# EAGLE design multi_sense32 (EAGLE 9.6.2)
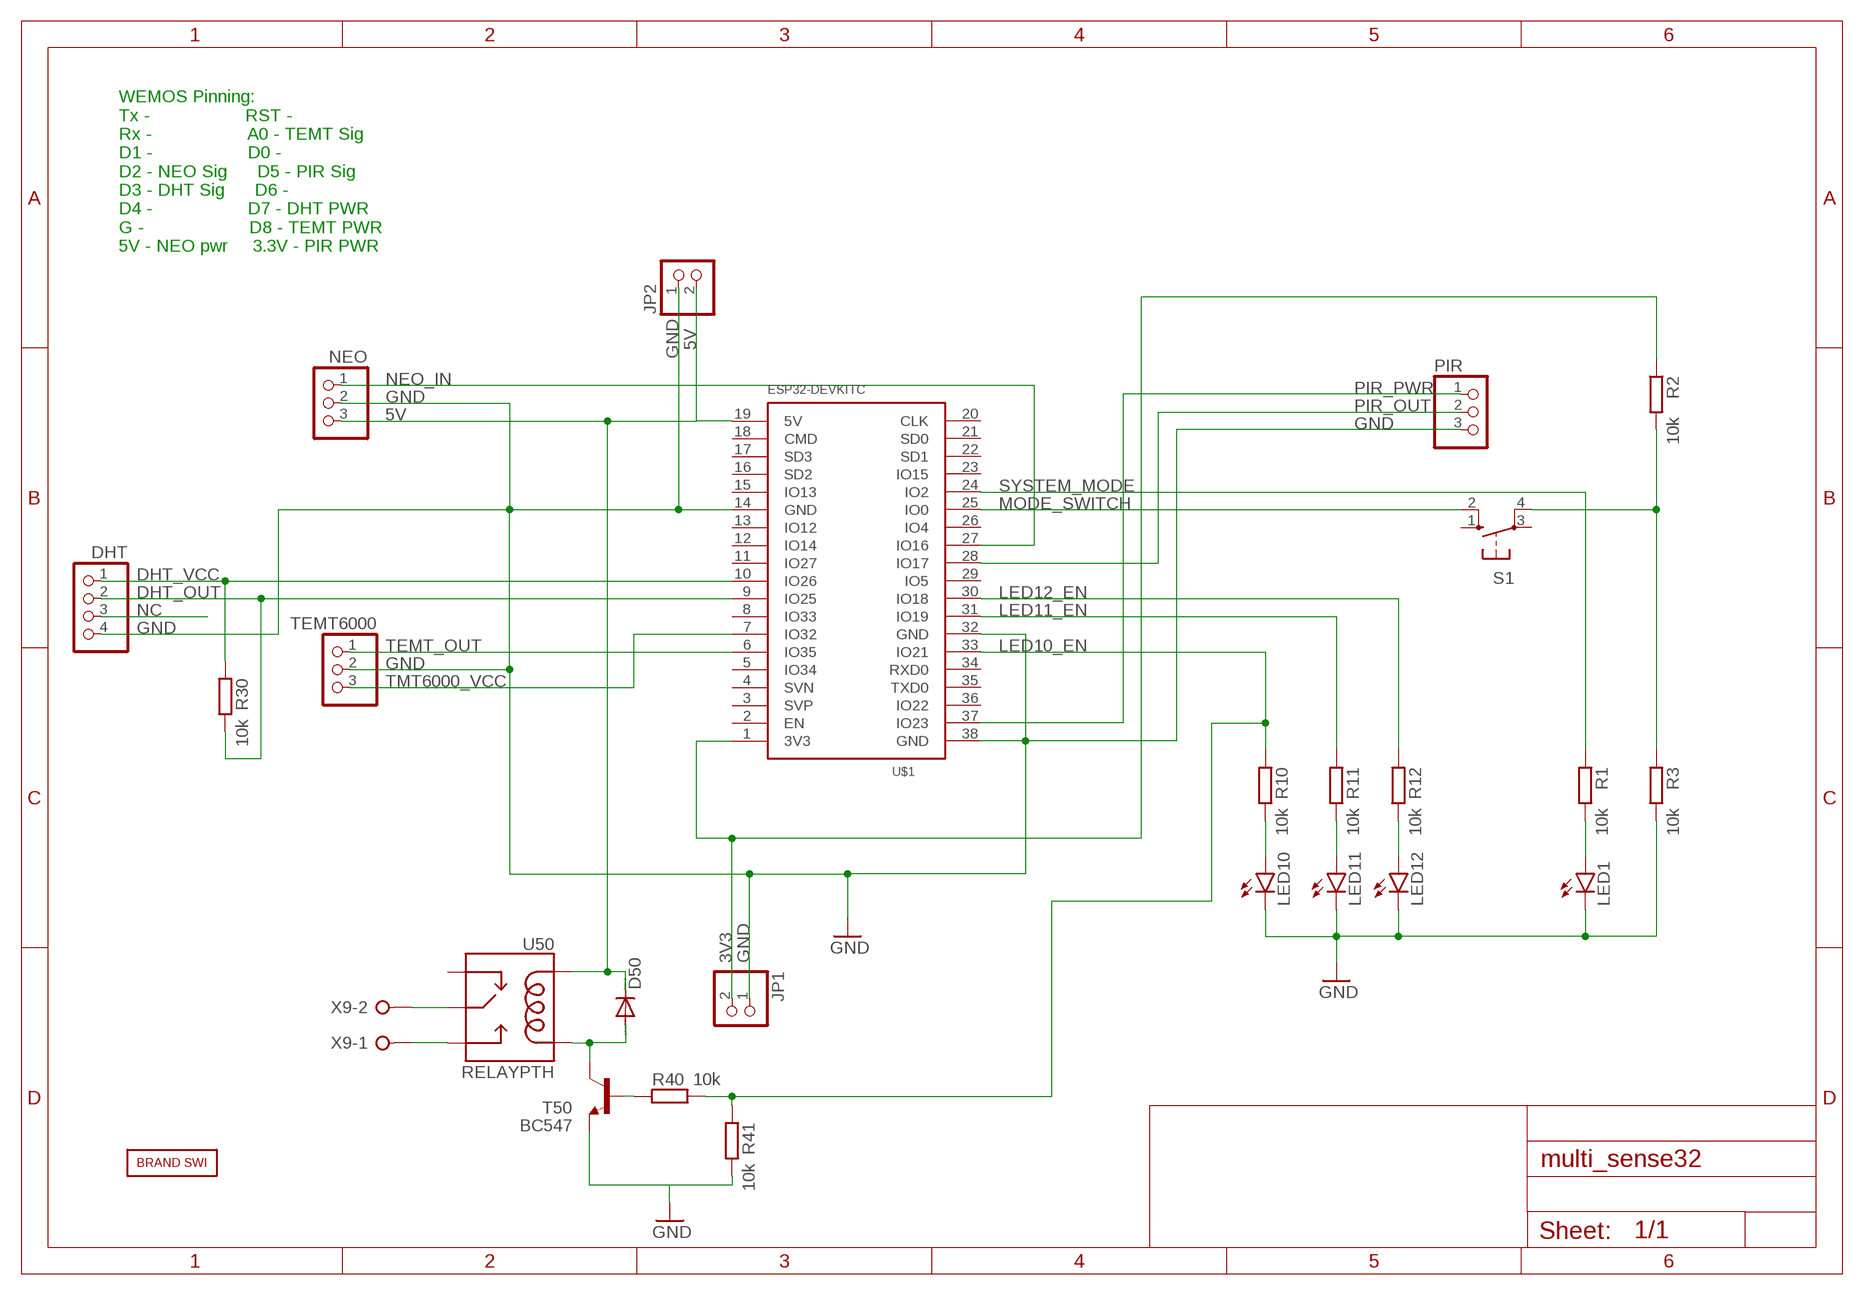
[diagram p0: schematic, sheet 1]

## Parts
D50  1N4148DO35-7  [DO35-7]
DHT  PINHD-1X4  [1X04]
JP1  PINHD-1X2  [1X02]
JP2  PINHD-1X2  [1X02]
LED1  LED3MM  [LED3MM]
LED10  LED3MM  [LED3MM]
LED11  LED3MM  [LED3MM]
LED12  LED3MM  [LED3MM]
NEO  PINHD-1X3  [1X03]
PIR  PINHD-1X3  [1X03]
R1  10k  R-EU_0207/10  [0207/10]
R2  10k  R-EU_0207/10  [0207/10]
R3  10k  R-EU_0207/10  [0207/10]
R10  10k  R-EU_0207/10  [0207/10]
R11  10k  R-EU_0207/10  [0207/10]
R12  10k  R-EU_0207/10  [0207/10]
R30  10k  R-EU_0207/10  [0207/10]
R40  10k  R-EU_0207/10  [0207/10]
R41  10k  R-EU_0207/10  [0207/10]
S1  10-XX  [B3F-10XX]
T50  BC547  [TO92]
TEMT6000  PINHD-1X3  [1X03]
U50  RELAYPTH  [SRD-05VDC-SL-C]
U$1  ESP32DEVKITC  [ESP32-DEVKITC]
U$2  BRAND_SWI5X7  [BRAND_SWI_5X7]
X9  W237-02P  [W237-132]

## Nets
3V3: JP1.2 R2.1 U$1.1(3V3)
5V: D50.C JP2.2 NEO.3 U50.COIL1 U$1.19(5V)
DHT_OUT: DHT.2 R30.2 U$1.9(IO25)
DHT_VCC: DHT.1 R30.1 U$1.10(IO26)
GND: DHT.4 JP1.1 JP2.1 LED1.K(C) LED10.K(C) LED11.K(C) LED12.K(C) NEO.2 PIR.3 R3.2 R41.2 T50.1(E) TEMT6000.2 U$1.14(GND) U$1.32(GND) U$1.38(GND)
LED10_EN: R10.1 R40.2 R41.1 U$1.33(IO21)
LED11_EN: R11.1 U$1.31(IO19)
LED12_EN: R12.1 U$1.30(IO18)
MODE_SWITCH: S1.2(S1) U$1.25(IO0)
N$1: U50.SWOPEN X9.1
N$2: LED10.A R10.2
N$3: U50.SWCOMMON X9.2
N$4: LED11.A R11.2
N$5: LED12.A R12.2
N$6: R2.2 R3.1 S1.4(P1)
N$9: LED1.A R1.2
N$22: D50.A T50.3(C) U50.COIL0
N$27: R40.1 T50.2(B)
NC: DHT.3
NEO_IN: NEO.1 U$1.27(IO16)
PIR_OUT: PIR.2 U$1.28(IO17)
PIR_PWR: PIR.1 U$1.37(IO23)
SYSTEM_MODE: R1.1 U$1.24(IO2)
TEMT_OUT: TEMT6000.1 U$1.6(IO35)
TMT6000_VCC: TEMT6000.3 U$1.7(IO32)
Unconnected: S1.1(S) S1.3(P) U50.SWCLOSED(SWCLOSE) U$1.2(EN) U$1.3(SVP) U$1.4(SVN) U$1.5(IO34) U$1.8(IO33) U$1.11(IO27) U$1.12(IO14) U$1.13(IO12) U$1.15(IO13) U$1.16(SD2) U$1.17(SD3) U$1.18(CMD) U$1.20(CLK) U$1.21(SD0) U$1.22(SD1) U$1.23(IO15) U$1.26(IO4) U$1.29(IO5) U$1.34(RXD0) U$1.35(TXD0) U$1.36(IO22)

## Notes on the sheet
- WEMOS Pinning:
  Tx -                   RST - 
  Rx -                   A0 - TEMT Sig
  D1 -                   D0 - 
  D2 - NEO Sig      D5 - PIR Sig
  D3 - DHT Sig      D6 - 
  D4 -                   D7 - DHT PWR
  G -                     D8 - TEMT PWR
  5V - NEO pwr     3.3V - PIR PWR

## Library data of the parts
D50 = diode:1N4148: DIODE high speed (Philips)
DHT = pinhead:PINHD-1X4: PIN HEADER
JP1 JP2 = pinhead:PINHD-1X2: PIN HEADER
LED1 LED10-LED12 = led:LED: LED OSRAM: - CHIPLED LG R971, LG N971, LY N971, LG Q971, LY Q971, LO R971, LY R971 LH N974, LH R974 LS Q976, LO Q976, LY Q976 LO Q996 - Hyper CHIPLED LW Q18S LB Q993, LB Q99A, LB R99A - SideLED LS A670, LO A670, LY A670, LG A670, LP A670 LB A673, LV A673, LT A673, LW A673 LH A674 LY A675 LS A676, LA A676, LO A676, LY A676, LW A676 LS A679, LY A679, LG A679 - Hyper Micro SIDELED® LS Y876, LA Y876, LO Y876, LY Y876 LT Y87S - SmartLED LW L88C, LW L88S LB L89C, LB L89S, LG L890 LS L89K, LO L89K, LY L89K LS L896, LA L896, LO L896, LY L896 - TOPLED LS T670, LO T670, LY T670, LG T670, LP T670 LSG T670, LSP T670, LSY T670, LOP T670, LYG T670 LG T671, LOG T671, LSG T671 LB T673, LV T673, LT T673, LW T673 LH T674 LS T676, LA T676, LO T676, LY T676, LB T676, LH T676, LSB T676, LW T676 LB T67C, LV T67C, LT T67C, LS T67K, LO T67K, LY T67K, LW E67C LS E67B, LA E67B, LO E67B, LY E67B, LB E67C, LV E67C, LT E67C LW T67C LS T679, LY T679, LG T679 LS T770, LO T770, LY T770, LG T770, LP T770 LB T773, LV T773, LT T773, LW T773 LH T774 LS E675, LA E675, LY E675, LS T675 LS T776, LA T776, LO T776, LY T776, LB T776 LHGB T686 LT T68C, LB T68C - Hyper Mini TOPLED® LB M676 - Mini TOPLED Santana® LG M470 LS M47K, LO M47K, LY M47K Source: http://www.osram.convergy.de LUXEON: - LUMILED® LXK2-PW12-R00, LXK2-PW12-S00, LXK2-PW14-U00, LXK2-PW14-V00 LXK2-PM12-R00, LXK2-PM12-S00, LXK2-PM14-U00 LXK2-PE12-Q00, LXK2-PE12-R00, LXK2-PE12-S00, LXK2-PE14-T00, LXK2-PE14-U00 LXK2-PB12-K00, LXK2-PB12-L00, LXK2-PB12-M00, LXK2-PB14-N00, LXK2-PB14-P00, LXK2-PB14-Q00 LXK2-PR12-L00, LXK2-PR12-M00, LXK2-PR14-Q00, LXK2-PR14-R00 LXK2-PD12-Q00, LXK2-PD12-R00, LXK2-PD12-S00 LXK2-PH12-R00, LXK2-PH12-S00 LXK2-PL12-P00, LXK2-PL12-Q00, LXK2-PL12-R00 Source: www.luxeon.com KINGBRIGHT: KA-3528ASYC Source: www.kingbright.com
NEO PIR TEMT6000 = pinhead:PINHD-1X3: PIN HEADER
R1-R3 R10-R12 R30 R40 R41 = rcl:R-EU_: RESISTOR, European symbol
S1 = switch-omron:10-XX: OMRON SWITCH; MPN: B3F-1000; OC_FARNELL: 176432; OC_NEWARK: 36M3542
T50 = transistor:BC547: NPN TRANSISTOR
U50 = SWI_COMMONS:RELAY: SPDT relay (COM-00101)
U$1 = SWI_COMMONS:ESP32DEVKITC
U$2 = BRAND_SWI:BRAND_SWI
X9 = con-wago-508:W237-02P: WAGO SREW CLAMP; OC_FARNELL: unknown; OC_NEWARK: unknown

## Board
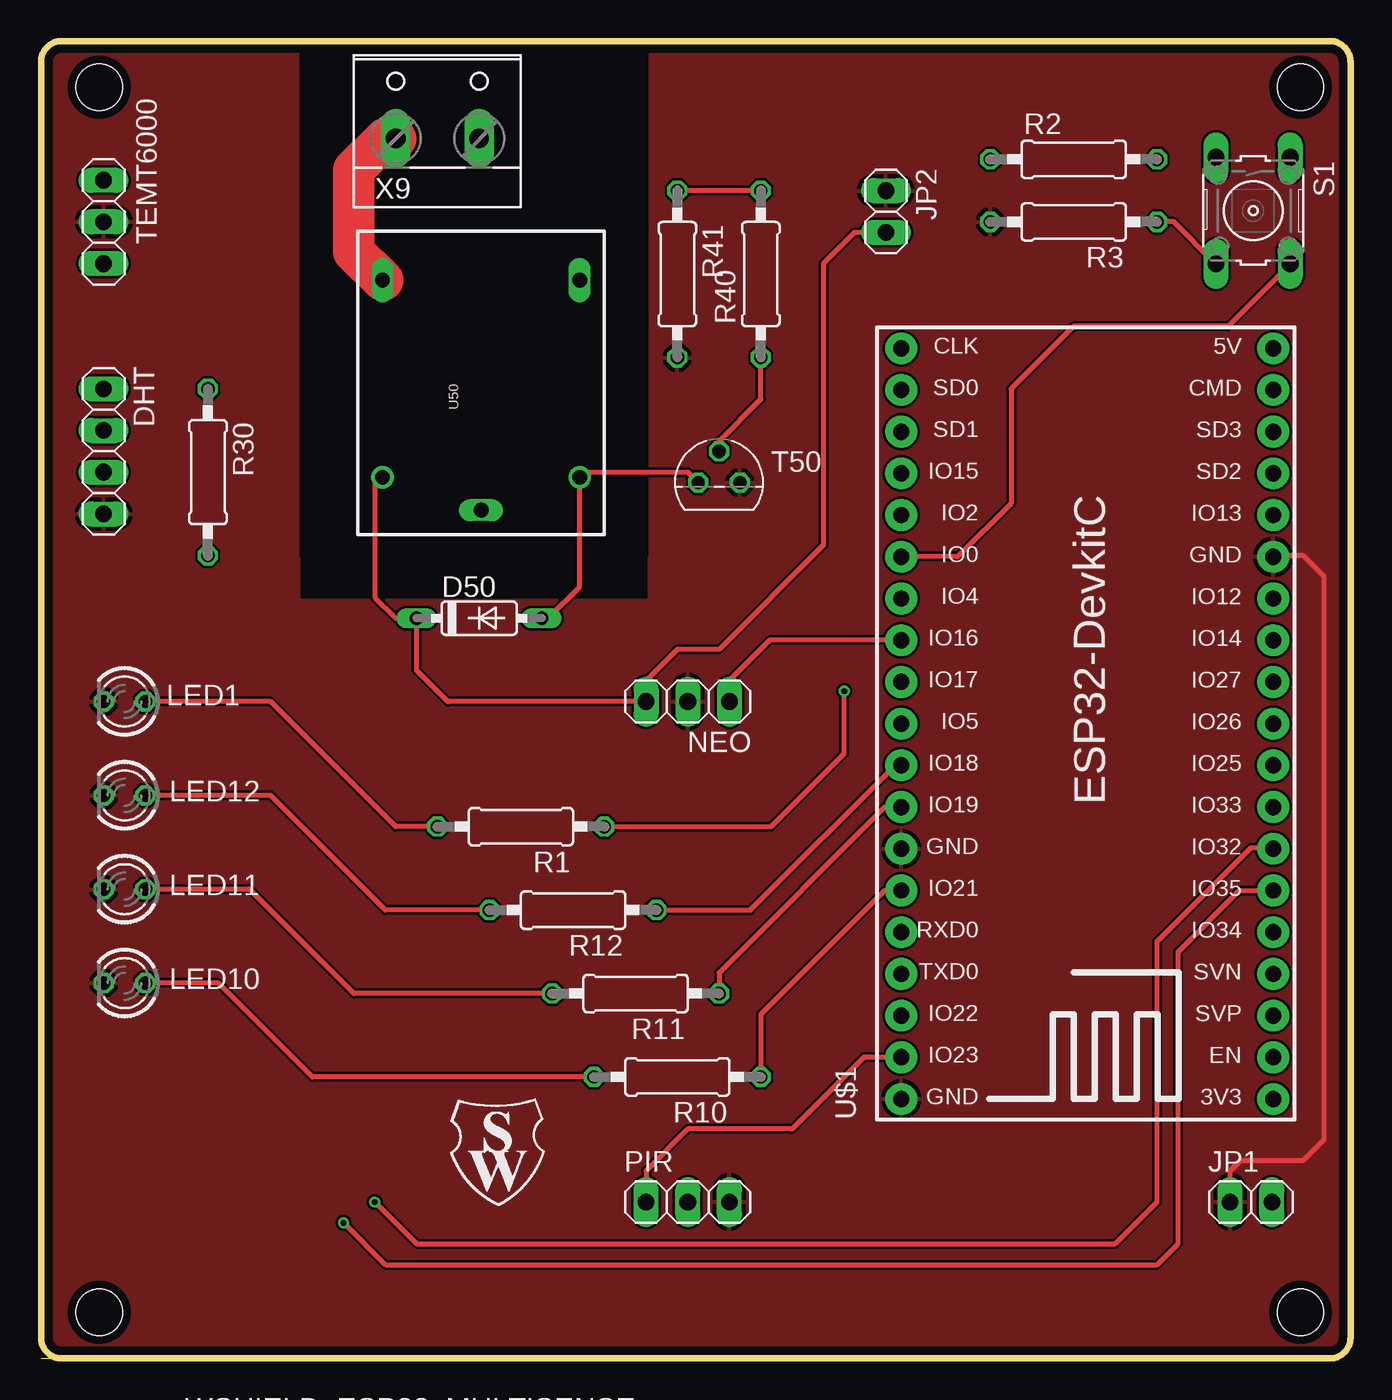
[diagram p1: board, top side]
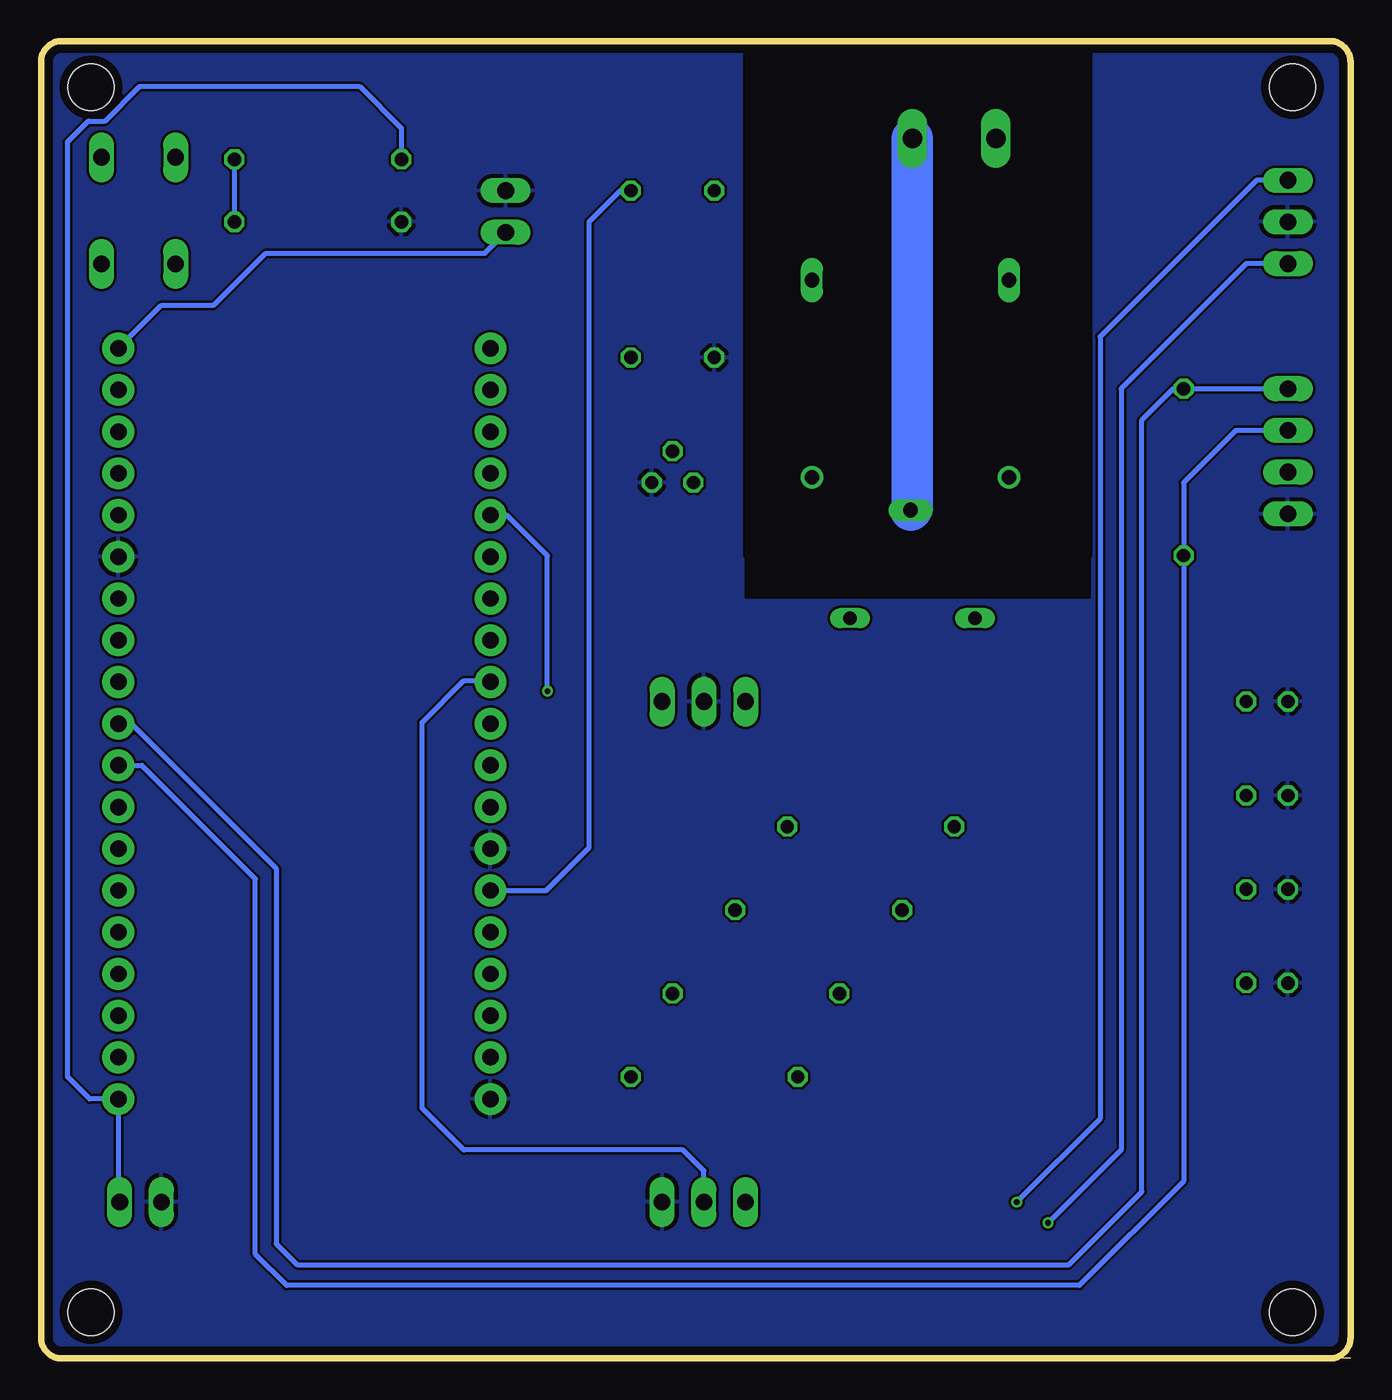
[diagram p2: board, bottom side, seen from below]

Size 79.72 x 80.23 mm. Coordinates in mm from the lower left corner, seen from the top.
Outline: 0,0 1.27,0
Outline: 1.27,0 2.03,0
Outline: 28.45,0 31.42,0
Outline: 1.27,0 78.45,0 arc90 79.72,1.27 79.72,78.96 arc90 78.45,80.23 1.27,80.23 arc90 0,78.96 0,1.27 arc90 1.27,0
Copper layers (1*16): Top 0.035mm / dielectric 1.6mm / Bottom 0.035mm
Design rules "Elecrow_2-layer_PCB_eagle_rule": minimum track width 6mil, minimum drill 12mil, track to track 6mil, track to pad 6mil, pad to pad 6mil, via to via 8mil, smd to smd 0mil, copper to edge 20mil, drill to drill 10mil, minimum pad ring 6mil, minimum via ring 6mil, stop-mask expansion 0mil, vias tented up to drill 100mil, thermal gap 10mil
Holes 2.8 mm at 3.54,77.42 76.68,77.42 76.68,2.81 3.54,2.81
tRestrict: area 15.9,50.2 to 36.8,80; area 15.9,48.9 to 36.8,50.2; area 15.9,46.4 to 36.8,48.9
bRestrict: area 15.9,50.2 to 36.8,80; area 15.9,48.9 to 36.8,50.2; area 15.9,46.4 to 36.8,48.9

### Footprints (pad centres in the part's own frame; a part is rotated, then mirrored left to right if it is on the bottom)
DO35-7 = drill 0.813 long: A 3.81,0; C -3.81,0
1X04 = drill 1.016 long: 1 -3.81,0; 2 -1.27,0; 3 1.27,0; 4 3.81,0
1X02 = drill 1.016 long: 1 -1.27,0; 2 1.27,0
LED3MM = drill 0.813 octagon: A -1.27,0; K 1.27,0
1X03 = drill 1.016 long: 1 -2.54,0; 2 0,0; 3 2.54,0
0207/10 = drill 0.813 octagon: 1 -5.08,0; 2 5.08,0
B3F-10XX = drill 1.016 long: 1 -3.251,2.261; 2 3.251,2.261; 3 -3.251,-2.261; 4 3.251,-2.261
TO92 = drill 0.813 octagon: 1 1.27,0; 2 0,1.905; 3 -1.27,0
SRD-05VDC-SL-C = drill 0.9: COIL0 -5.39,-6.12; COIL1 -5.39,5.88 | drill 0.9 long: SWCLOSED 6.61,-6.12; SWCOMMON -7.39,-0.12; SWOPEN 6.61,5.88
ESP32-DEVKITC = drill 1 pad 1.93: 1 -22.87,-11.42; 2 -20.33,-11.42; 3 -17.79,-11.42; 4 -15.25,-11.42; 5 -12.71,-11.42; 6 -10.17,-11.42; 7 -7.63,-11.42; 8 -5.09,-11.42; 9 -2.55,-11.42; 10 -0.01,-11.42; 11 2.53,-11.42; 12 5.07,-11.42; 13 7.61,-11.42; 14 10.15,-11.42; 15 12.69,-11.42; 16 15.23,-11.42; 17 17.77,-11.42; 18 20.31,-11.42; 19 22.85,-11.42; 20 22.85,11.23; 21 20.31,11.23; 22 17.77,11.23; 23 15.23,11.23; 24 12.69,11.23; 25 10.15,11.23; 26 7.61,11.23; 27 5.07,11.23; 28 2.53,11.23; 29 -0.01,11.23; 30 -2.55,11.23; 31 -5.09,11.23; 32 -7.63,11.23; 33 -10.17,11.23; 34 -12.71,11.23; 35 -15.25,11.23; 36 -17.79,11.23; 37 -20.33,11.23; 38 -22.87,11.23
W237-132 = drill 1.194 long: 1 -2.54,-0.635; 2 2.54,-0.635

### Placement (x,y rotation side)
D50  26.67,45.09 0 top
DHT  3.81,55.24 270 top
JP1  73.66,9.53 0 top
JP2  51.44,69.85 270 top
LED1  5.08,40.01 180 top
LED10  5.08,22.86 180 top
LED11  5.08,28.57 180 top
LED12  5.08,34.29 180 top
NEO  39.37,40.01 180 top
PIR  39.37,9.53 0 top
R1  29.21,32.38 180 top
R2  62.87,73.03 0 top
R3  62.87,69.22 180 top
R10  38.73,17.14 180 top
R11  36.2,22.23 180 top
R12  32.38,27.3 180 top
R30  10.16,53.98 270 top
R40  43.81,66.04 90 top
R41  38.73,66.04 270 top
S1  73.79,69.9 270 top
T50  41.27,53.34 0 top
TEMT6000  3.81,69.22 90 top
U50  26.67,59.05 90 top
U$1  63.59,38.67 90 top
U$2  24.72,9.14 0 top
X9  24.13,74.93 0 top

### Tracks (layer width: path | path; a pad name or v marks a point on that pad's centre or on a via)
3V3
  Bottom 0.305: JP1.2 75.02,9.61 U$1.1 76.76,15.8 78.11,17.14 78.11,74.09 76.83,75.36 75.83,75.36 73.72,77.47 60.33,77.47 57.78,74.93 R2.1
5V
  Top 0.305: JP2.2 49.53,68.58 47.62,66.67 47.62,49.53 41.27,43.18 38.73,43.18 36.83,41.27 NEO.3 24.77,40.01 22.86,41.91 D50.C 21.59,45.09 20.32,46.35 20.32,53.2 U50.COIL1
  Bottom 0.305: U$1.19 72.4,64.14 69.22,64.14 66.04,67.31 52.7,67.31 JP2.2
DHT_OUT
  Bottom 0.305: DHT.2 6.99,56.52 10.16,53.34 R30.2 10.16,10.79 16.51,4.45 64.77,4.45 66.67,6.35 66.67,29.21 73.59,36.12 U$1.9
DHT_VCC
  Bottom 0.305: DHT.1 R30.1 10.79,59.05 12.7,57.15 12.7,10.16 17.14,5.71 64.14,5.71 65.41,6.99 65.41,29.84 74.22,38.66 U$1.10
GND
  Top 0.305: JP1.1 72.39,11.43 73.03,12.06 76.83,12.06 78.11,13.34 78.11,47.62 76.83,48.9 75.09,48.9 U$1.14
  pour Top: 0,0 80.01,0 80.01,80.01 0,80.01
  pour Bottom: 0,0 80.01,0 80.01,80.01 0,80.01
LED10_EN
  Top 0.305: R10.1 43.81,20.95 51.36,28.5 U$1.33 | R40.2 R41.1
  Bottom 0.305: U$1.33 48.97,28.5 46.35,31.11 46.35,69.22 44.45,71.12 R40.2
LED11_EN
  Top 0.305: R11.1 41.27,23.5 51.36,33.58 U$1.31
LED12_EN
  Top 0.305: R12.1 43.18,27.3 52,36.12 U$1.30
MODE_SWITCH
  Top 0.305: S1.2 72.26,62.87 62.87,62.87 59.05,59.05 59.05,52.07 55.81,48.82 U$1.25
N$1
  Top 2.54: U50.SWOPEN 19.05,67.41 19.05,72.39 20.95,74.3 X9.1
N$2
  Top 0.305: R10.2 16.51,17.14 10.79,22.86 LED10.A
N$3
  Bottom 2.54: X9.2 26.67,51.78 U50.SWCOMMON
N$4
  Top 0.305: R11.2 19.05,22.23 12.7,28.57 LED11.A
N$5
  Top 0.305: R12.2 20.95,27.3 13.97,34.29 LED12.A
N$6
  Top 0.305: S1.4 68.96,69.22 R3.1
  Bottom 0.305: R2.2 R3.1
N$9
  Top 0.305: R1.2 21.59,32.38 13.97,40.01 LED1.A
N$22
  Top 0.305: T50.3 39.37,53.98 33.1,53.98 U50.COIL0 32.79,46.99 30.89,45.09 D50.A
N$27
  Top 0.305: T50.2 41.27,55.88 43.81,58.42 R40.1
NEO_IN
  Top 0.305: U$1.27 44.38,43.74 41.91,41.27 NEO.1
PIR_OUT
  Bottom 0.305: PIR.2 39.37,11.43 40.64,12.7 53.98,12.7 56.52,15.24 56.52,38.73 53.98,41.27 52.44,41.27 U$1.28
PIR_PWR
  Top 0.305: U$1.37 50.09,18.34 45.72,13.97 39.37,13.97 36.83,11.43 PIR.1
SYSTEM_MODE  (via drill 0.35)
  Top 0.305: v48.9,40.64 48.9,36.83 44.45,32.38 R1.1
  Bottom 0.305: U$1.24 51.36,51.36 48.9,48.9 v48.9,40.64
TEMT_OUT  (via drill 0.35)
  Top 0.305: v18.41,8.26 20.95,5.71 67.94,5.71 69.22,6.99 69.22,24.77 72.95,28.5 U$1.6
  Bottom 0.305: TEMT6000.1 6.35,66.67 13.97,59.05 13.97,12.7 v18.41,8.26
TMT6000_VCC  (via drill 0.35)
  Top 0.305: v20.32,9.53 22.86,6.99 65.41,6.99 67.94,9.53 67.94,25.4 73.66,31.11 74.94,31.11 U$1.7
  Bottom 0.305: TEMT6000.3 5.71,71.75 15.24,62.23 15.24,14.61 v20.32,9.53

### Text on the board
tNames: WSHIELD_ESP32_MULTISENSE | PN39019R0B0
tRestrict: WSHIELD_MCP_BASIC | PN39022R1B1